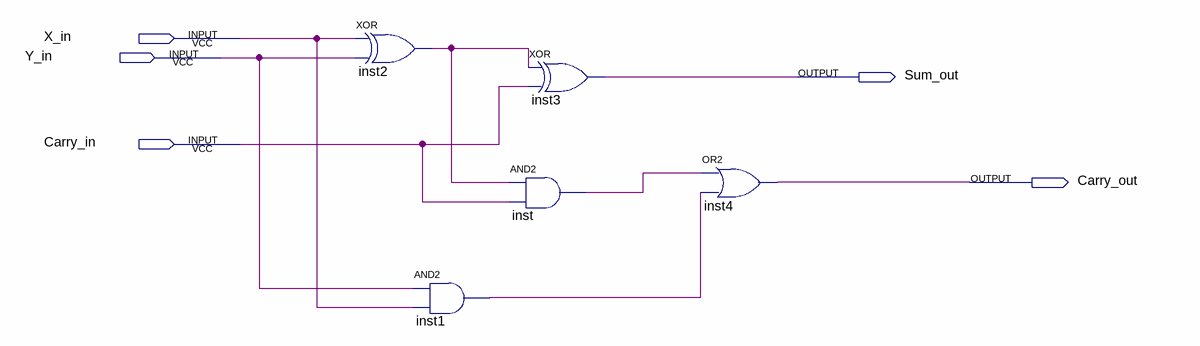
[diagram p0: schematic sheet]
// Quartus schematic fulladder1bit.bdf as structural Verilog: 5 symbols, 5 pins
module fulladder1bit (
  input  X_in,
  input  Y_in,
  input  Carry_in,
  output Sum_out,
  output Carry_out
);

  wire inst1_out, inst2_out, inst_out;

  xor inst2 (inst2_out, X_in, Y_in);
  and inst1 (inst1_out, Y_in, X_in);
  xor inst3 (Sum_out, inst2_out, Carry_in);
  and inst (inst_out, inst2_out, Carry_in);
  or inst4 (Carry_out, inst_out, inst1_out);
endmodule
